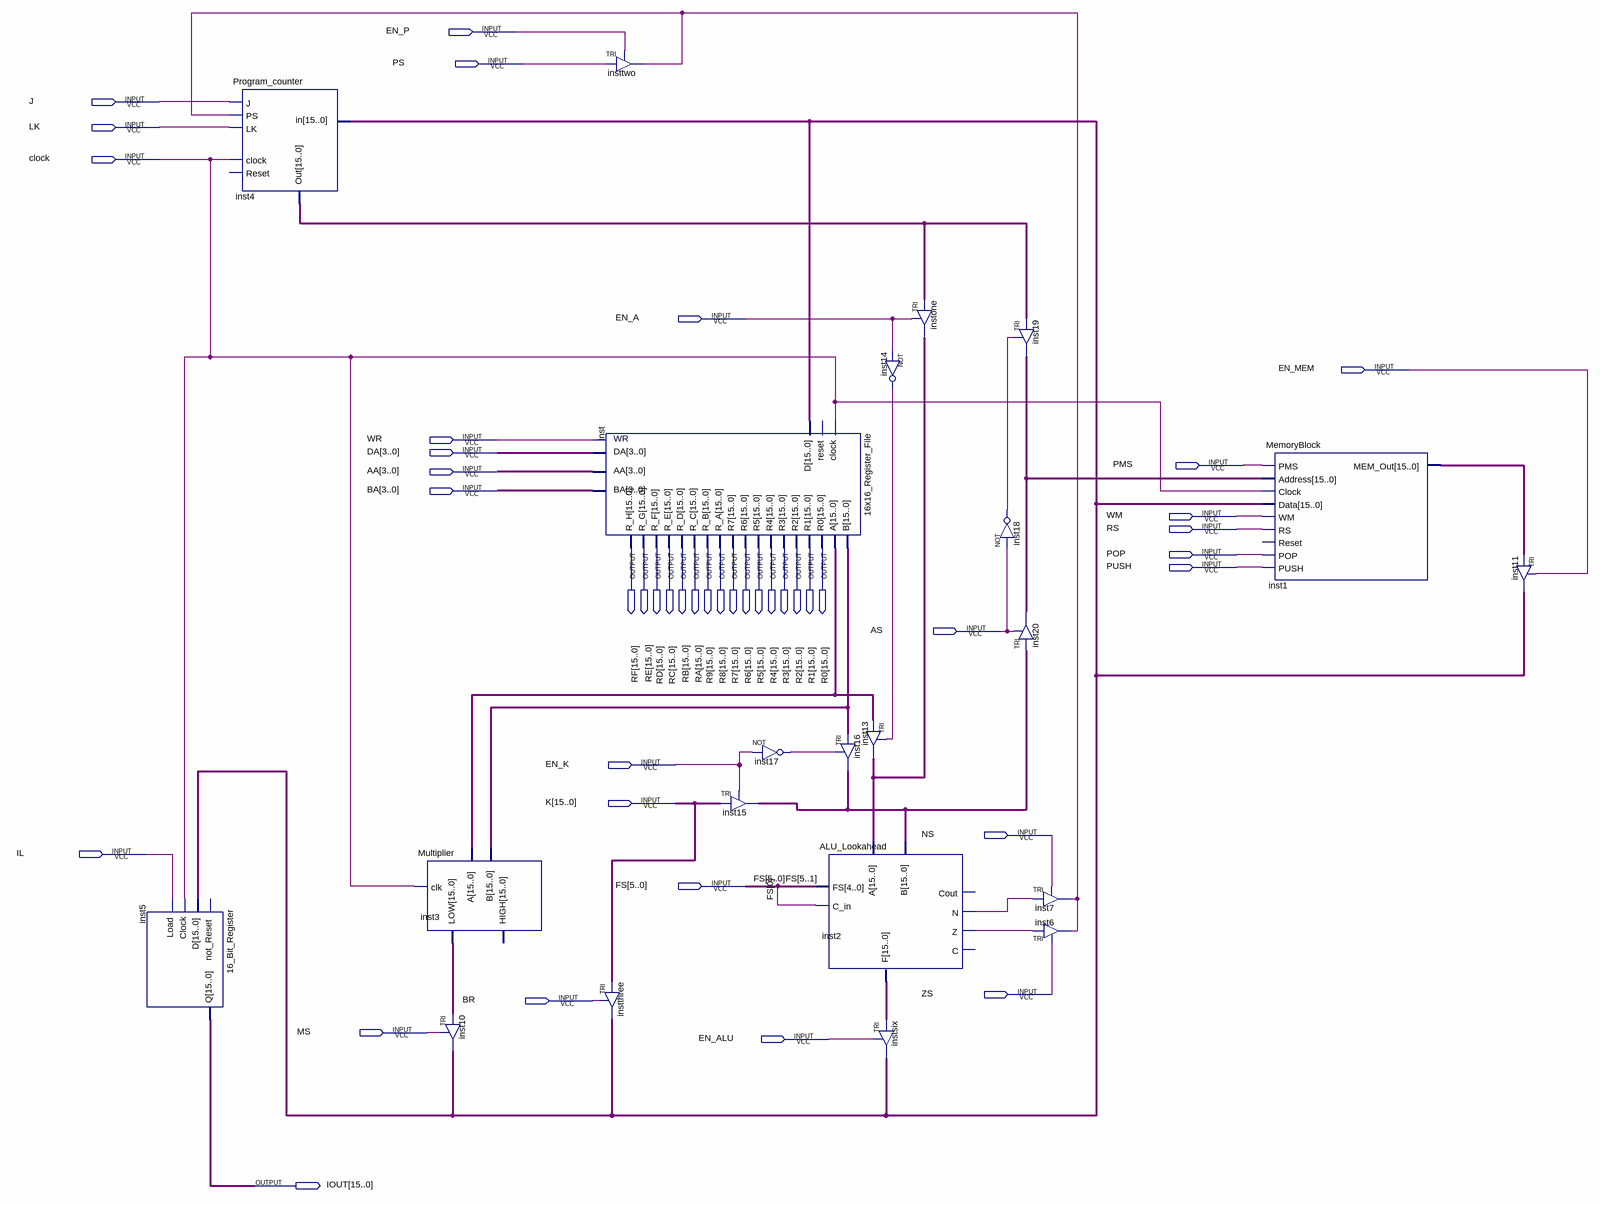
[diagram p0: schematic sheet]
// Quartus schematic Datapath_v2.bdf as structural Verilog: 22 symbols, 43 pins
module Datapath_v2 (
  input  EN_P,
  input  PS,
  input  J,
  input  LK,
  input  clock,
  input  EN_A,
  input  EN_MEM,
  input  WR,
  input  [3:0] DA,
  input  PMS,
  input  [3:0] AA,
  input  [3:0] BA,
  input  WM,
  input  RS,
  input  POP,
  input  PUSH,
  input  AS,
  input  EN_K,
  input  [15:0] K,
  input  NS,
  input  IL,
  input  [5:0] FS,
  input  ZS,
  input  BR,
  input  MS,
  input  EN_ALU,
  output [15:0] RF,
  output [15:0] RE,
  output [15:0] RD,
  output [15:0] RC,
  output [15:0] RB,
  output [15:0] RA,
  output [15:0] R9,
  output [15:0] R8,
  output [15:0] R7,
  output [15:0] R6,
  output [15:0] R5,
  output [15:0] R4,
  output [15:0] R3,
  output [15:0] R2,
  output [15:0] R1,
  output [15:0] R0,
  output [15:0] IOUT
);

  wire inst2_n, inst2_z, inst14_out, inst17_out, inst18_out, insttwo_out;
  wire [15:0] inst1_mem_out, inst2_f, inst3_low, inst4_out, inst10_out, inst13_out, inst15_out, inst19_out,
       inst_a, inst_b;

  \16_Bit_Register  inst5 (.D(inst10_out), .Clock(clock), .Load(IL), .Q(IOUT));  // open: not_Reset
  Program_counter inst4 (
    .J(J), .in(inst10_out), .LK(LK), .clock(clock), .PS(insttwo_out), .Out(inst4_out));  // open: Reset
  Multiplier inst3 (.A(inst_a), .clk(clock), .B(inst_b), .LOW(inst3_low));  // open: HIGH
  TRI inst10[15:0] (.IN(inst3_low), .OE(MS), .OUT(inst10_out));
  \16x16_Register_File  inst (
    .WR(WR), .clock(clock), .D(inst10_out), .DA(DA), .AA(AA), .BA(BA), .R0(R0), .R1(R1), .R2(R2), .R3(R3),
    .R4(R4), .R5(R5), .R6(R6), .R7(R7), .A(inst_a), .B(inst_b), .R_A(R8), .R_B(R9), .R_C(RA), .R_D(RB),
    .R_E(RC), .R_F(RD), .R_G(RE), .R_H(RF));  // open: reset
  TRI instthree[15:0] (.IN(K), .OE(BR), .OUT(inst10_out));
  TRI insttwo (.IN(PS), .OE(EN_P), .OUT(insttwo_out));
  not inst17 (inst17_out, EN_K);
  TRI inst15[15:0] (.IN(K), .OE(EN_K), .OUT(inst15_out));
  TRI inst16[15:0] (.IN(inst_b), .OE(inst17_out), .OUT(inst15_out));
  ALU_Lookahead inst2 (
    .FS(FS[5:1]), .A(inst13_out), .B(inst15_out), .C_in(FS[0]), .F(inst2_f), .N(inst2_n), .Z(inst2_z));  // open: Cout, C
  not inst14 (inst14_out, EN_A);
  TRI inst13[15:0] (.IN(inst_a), .OE(inst14_out), .OUT(inst13_out));
  TRI instsix[15:0] (.IN(inst2_f), .OE(EN_ALU), .OUT(inst10_out));
  TRI instone[15:0] (.IN(inst4_out), .OE(EN_A), .OUT(inst13_out));
  not inst18 (inst18_out, AS);
  TRI inst19[15:0] (.IN(inst4_out), .OE(inst18_out), .OUT(inst19_out));
  TRI inst20[15:0] (.IN(inst15_out), .OE(AS), .OUT(inst19_out));
  TRI inst7 (.IN(inst2_n), .OE(NS), .OUT(insttwo_out));
  TRI inst6 (.IN(inst2_z), .OE(ZS), .OUT(insttwo_out));
  MemoryBlock inst1 (
    .PMS(PMS), .Address(inst19_out), .Clock(clock), .Data(inst10_out), .WM(WM), .RS(RS), .POP(POP),
    .PUSH(PUSH), .MEM_Out(inst1_mem_out));  // open: Reset
  TRI inst11[15:0] (.IN(inst1_mem_out), .OE(EN_MEM), .OUT(inst10_out));
endmodule
